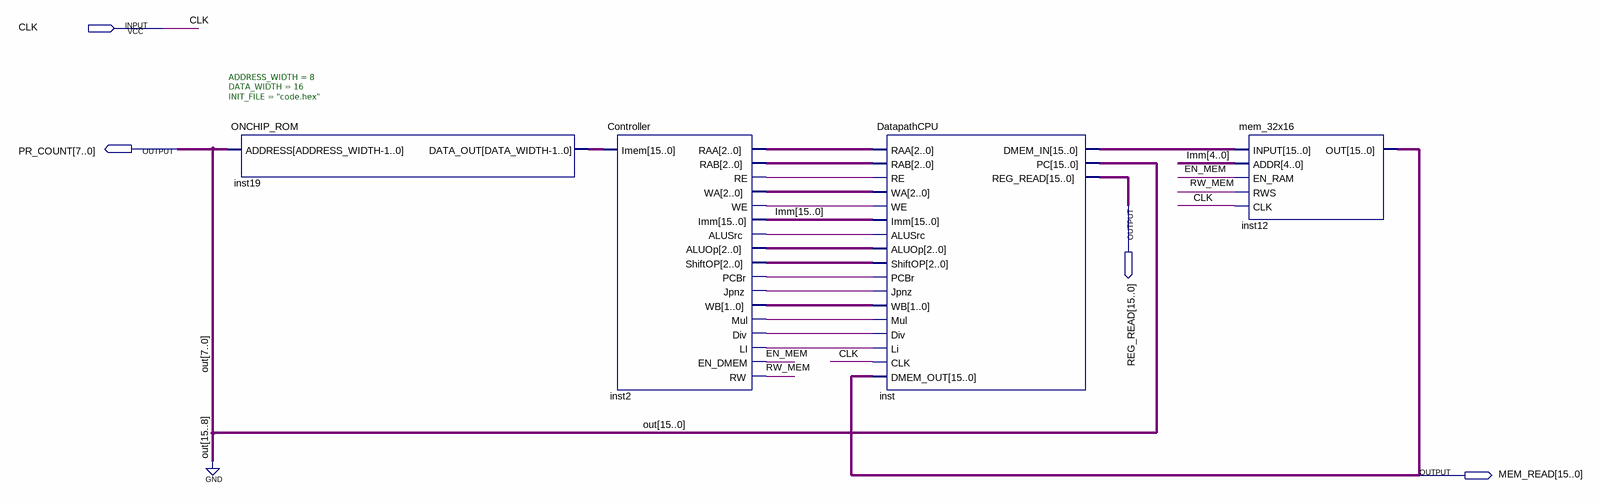
[diagram p0: schematic sheet]
// Quartus schematic CPU.bdf as structural Verilog: 4 symbols, 4 pins
module CPU (
  input  CLK,
  output [7:0] PR_COUNT,
  output [15:0] REG_READ,
  output [15:0] MEM_READ
);

  wire EN_MEM, inst2_alusrc, inst2_div, inst2_jpnz, inst2_li, inst2_mul, inst2_pcbr, inst2_re, inst2_we,
       RW_MEM;
  wire [1:0] inst2_wb;
  wire [2:0] inst2_aluop, inst2_raa, inst2_rab, inst2_shiftop, inst2_wa;
  wire [15:0] Imm, inst19_data_out, inst_dmem_in;
  wire [15:8] out;

  ONCHIP_ROM #(.ADDRESS_WIDTH(8), .DATA_WIDTH(16), .INIT_FILE("code.hex")) inst19 (
    .ADDRESS(PR_COUNT), .DATA_OUT(inst19_data_out));
  Controller inst2 (
    .Imem(inst19_data_out), .RAA(inst2_raa), .RAB(inst2_rab), .WA(inst2_wa), .Imm(Imm), .ALUOp(inst2_aluop),
    .WB(inst2_wb), .RE(inst2_re), .ShiftOP(inst2_shiftop), .WE(inst2_we), .Mul(inst2_mul), .EN_DMEM(EN_MEM),
    .Div(inst2_div), .PCBr(inst2_pcbr), .RW(RW_MEM), .LI(inst2_li), .ALUSrc(inst2_alusrc), .Jpnz(inst2_jpnz));
  DatapathCPU inst (
    .RAA(inst2_raa), .RAB(inst2_rab), .RE(inst2_re), .WA(inst2_wa), .WE(inst2_we), .Imm(Imm),
    .ALUSrc(inst2_alusrc), .ALUOp(inst2_aluop), .ShiftOP(inst2_shiftop), .PCBr(inst2_pcbr),
    .Jpnz(inst2_jpnz), .WB(inst2_wb), .Mul(inst2_mul), .Div(inst2_div), .Li(inst2_li), .CLK(CLK),
    .DMEM_OUT(MEM_READ), .DMEM_IN(inst_dmem_in), .PC({out, PR_COUNT}), .REG_READ(REG_READ));
  mem_32x16 inst12 (.INPUT(inst_dmem_in), .ADDR(Imm[4:0]), .EN_RAM(EN_MEM), .RWS(RW_MEM), .CLK(CLK), .OUT(MEM_READ));
  // also tied to GND on the sheet: {out[8], out[9], out[10], out[11], out[12], out[13], out[14], out[15]}

  // Other names for the same wires on the sheet: out[7:0] = PR_COUNT
endmodule
